# Altium schematic sheet rf_router_trsw.SchDoc: mcHF Pro Transceiver RF board
size A3; Author: Krassi Atanassov; CompanyName: MØNKA; Engineer: For radio amateurs experimentation, non-commercial use only. Thank you!; Revision: 0.8.2; SheetTotal: 14
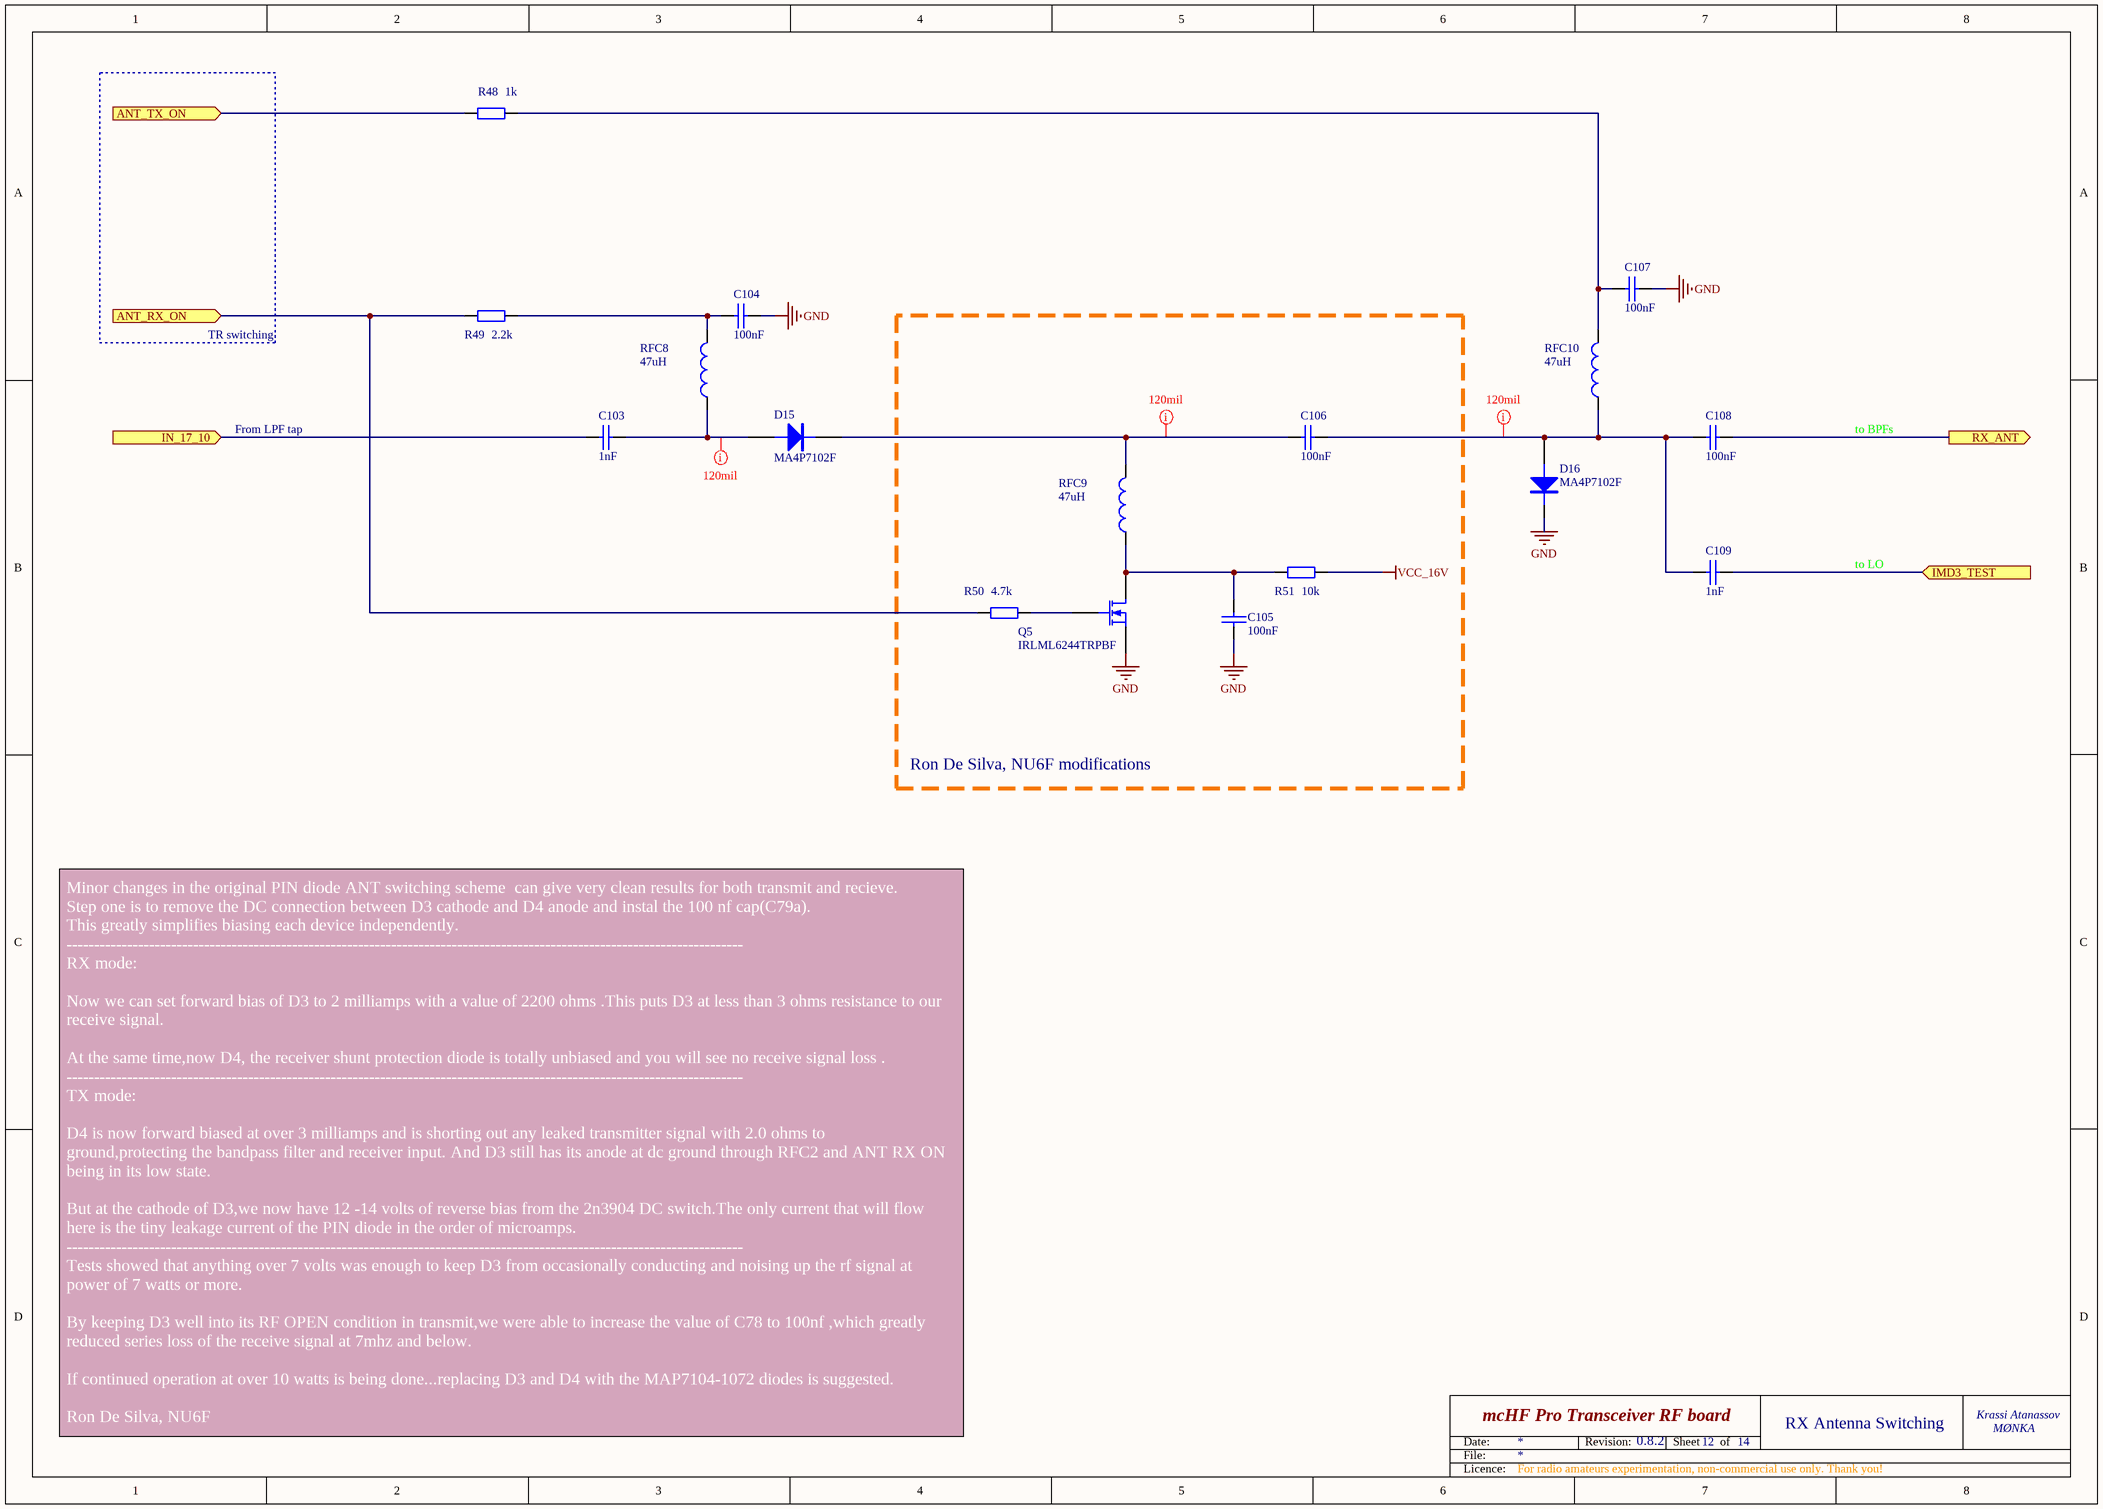
[diagram p0: rf_router_trsw.SchDoc]

## Parts
C103  1nF  [0805]
C104  100nF  [0805]
C105  100nF  [0805]
C106  100nF  [0805]
C107  100nF  [0805]
C108  100nF  [0805]
C109  1nF  [0805]
D15  MA4P7102F  [1072T]
D16  MA4P7102F  [1072T]
Q5  IRLML6244TRPBF  [SOT-23-Pro]
R48  1k  [0805]
R49  2.2k  [0805]
R50  4.7k  [0805]
R51  10k  [0805]
RFC8  47uH  [0805]
RFC9  47uH  [0805]
RFC10  47uH  [0805]

## Blocks framed on the sheet
Ron De Silva, NU6F modifications: C105 C106 Q5 R50 R51 RFC9

## Ports
ANT_RX_ON (in), ANT_TX_ON (in), IMD3_TEST (in), IN_17_10 (in), RX_ANT (out)

## Nets
GND: C104.1 C105.2 C107.1 D16.1(K) Q5.2(S)
VCC_16V: R51.2
ANT_RX_ON: R49.1 R50.1 ; port ANT_RX_ON
ANT_TX_ON: R48.2 ; port ANT_TX_ON
IMD3_TEST: C109.1 ; port IMD3_TEST
IN_17_10: C103.2 ; port IN_17_10
RX_ANT: C108.1 ; port RX_ANT
NetC103_1: C103.1 D15.2(A) RFC8.1
NetC104_2: C104.2 R49.2 RFC8.2
NetC105_1: C105.1 Q5.3(D) R51.1 RFC9.1
NetC106_1: C106.1 C108.2 C109.2 D16.2(A) RFC10.1
NetC106_2: C106.2 D15.1(K) RFC9.2
NetC107_2: C107.2 R48.1 RFC10.2
NetQ5_1: Q5.1(G) R50.2

## Layout directives
rule Width Constraint [Pref Width = 120mil    Min Width = 120mil    Max Width = 120mil]: NetC103_1, NetC106_1, NetC106_2

## Notes on the sheet
- TR switching
- From LPF tap
- to BPFs
- to LO
- Minor changes in the original PIN diode ANT switching scheme  can give very clean results for both transmit and recieve.
  Step one is to remove the DC connection between D3 cathode and D4 anode and instal the 100 nf cap(C79a).
  This greatly simplifies biasing each device independently.
  ---------------------------------------------------------------------------------------------------------------------------
  RX mode:
  Now we can set forward bias of D3 to 2 milliamps with a value of 2200 ohms .This puts D3 at less than 3 ohms resistance to our receive signal.
  At the same time,now D4, the receiver shunt protection diode is totally unbiased and you will see no receive signal loss .
  ---------------------------------------------------------------------------------------------------------------------------
  TX mode:
  D4 is now forward biased at over 3 milliamps and is shorting out any leaked transmitter signal with 2.0 ohms to
  ground,protecting the bandpass filter and receiver input. And D3 still has its anode at dc ground through RFC2 and ANT RX ON being in its low state.
  But at the cathode of D3,we now have 12 -14 volts of reverse bias from the 2n3904 DC switch.The only current that will flow here is the tiny leakage current of the PIN diode in the order of microamps.
  ---------------------------------------------------------------------------------------------------------------------------
  Tests showed that anything over 7 volts was enough to keep D3 from occasionally conducting and noising up the rf signal at power of 7 watts or more.
  By keeping D3 well into its RF OPEN condition in transmit,we were able to increase the value of C78 to 100nf ,which greatly reduced series loss of the receive signal at 7mhz and below.
  If continued operation at over 10 watts is being done...replacing D3 and D4 with the MAP7104-1072 diodes is suggested.
  Ron De Silva, NU6F
- 12
- RX Antenna Switching
- Date:
- File:
- Revision:
- Sheet
- of
- Licence:

## Library data of the parts
C103 C108 C109 = CAP: Capacitor; Voltage: 100V
  C103: Price: 0.083
C104-C107 = CAP: Capacitor; Voltage: 100V; QT Order: QCC-00154; Price: 0.068
D15 D16 = MA4P7102F: MELF & HIPAX PIN Diod; Order: DK 1465-1236-1-ND; Price: 2.20
Q5 = MOSFET-N: N-Channel MOSFET; QT Order: QCT-00022; QT Price: 0.28; Price: 0.231
R48 = RES: Resistor; QT Order: QCR-00309; Price: 0.007
R49-R51 = RES: Resistor; QT Order: QCR-00339; Price: 0.012
RFC8-RFC10 = TDK-NLV25T: INDUCTOR, SIGNAL LINE, 47UH, 1005; Price: 0.166